# Altium project fieldsensor.PrjPCB
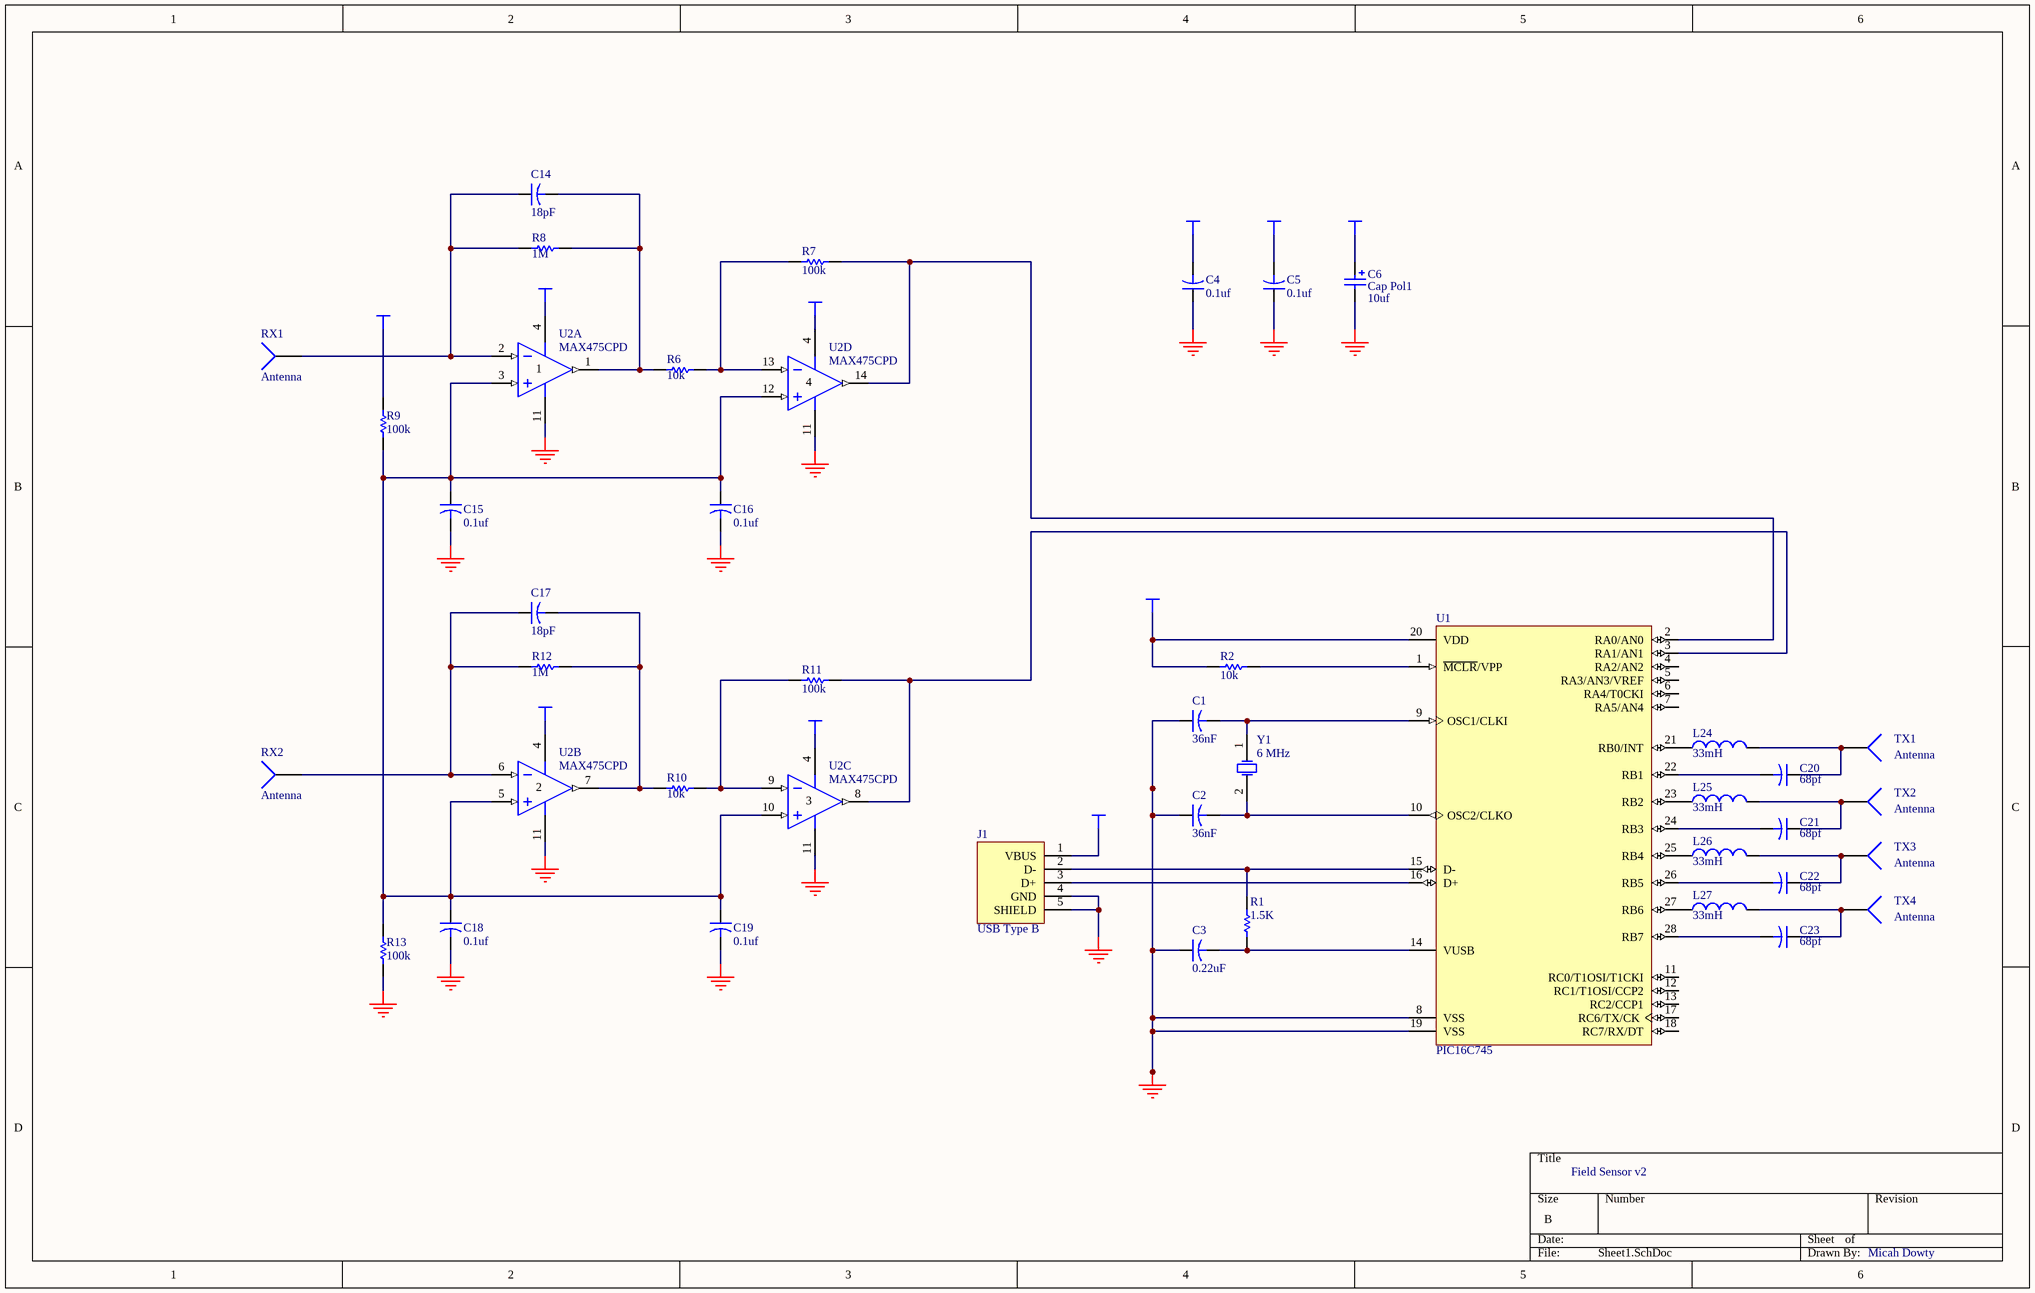
[diagram p0: Sheet1.SchDoc]
1 sheet, 40 parts. Net scope: global (net labels, ports and power ports of the same name join across sheets).
Board file: PCB1.PcbDoc

## Sheet Sheet1.SchDoc
size B

### Parts
C1  value 36nF  [CAPR5-4X5]  (hidden comment: Cap2)
C2  value 36nF  [CAPR5-4X5]  (hidden comment: Cap2)
C3  value 0.22uF  [CAPR5-4X5]
C4  value 0.1uf  [CAPR5-4X5]
C5  value 0.1uf  [CAPR5-4X5]
C6  Cap Pol1  value 10uf  [CAP-EE-1]
C14  value 18pF  [CAPR5-4X5]  (hidden comment: Cap2)
C15  value 0.1uf  [CAPR5-4X5]  (hidden comment: Cap2)
C16  value 0.1uf  [CAPR5-4X5]  (hidden comment: Cap2)
C17  value 18pF  [CAPR5-4X5]  (hidden comment: Cap2)
C18  value 0.1uf  [CAPR5-4X5]  (hidden comment: Cap2)
C19  value 0.1uf  [CAPR5-4X5]  (hidden comment: Cap2)
C20  value 68pf  [CAPR5-4X5]  (hidden comment: Cap2)
C21  value 68pf  [CAPR5-4X5]  (hidden comment: Cap2)
C22  value 68pf  [CAPR5-4X5]  (hidden comment: Cap2)
C23  value 68pf  [CAPR5-4X5]  (hidden comment: Cap2)
J1  USB  [USB-TYPEB]  (value not drawn)
L24  value 33mH  [RAD-0.2]
L25  value 33mH  [RAD-0.2]
L26  value 33mH  [RAD-0.2]
L27  value 33mH  [RAD-0.2]
R1  value 1.5K  [AXIAL-0.3]  (hidden comment: Res1)
R2  value 10k  [AXIAL-0.3]  (hidden comment: Res1)
R6  value 10k  [AXIAL-0.3]  (hidden comment: Res1)
R7  value 100k  [AXIAL-0.3]  (hidden comment: Res1)
R8  value 1M  [AXIAL-0.3]  (hidden comment: Res1)
R9  value 100k  [AXIAL-0.3]  (hidden comment: Res1)
R10  value 10k  [AXIAL-0.3]  (hidden comment: Res1)
R11  value 100k  [AXIAL-0.3]  (hidden comment: Res1)
R12  value 1M  [AXIAL-0.3]  (hidden comment: Res1)
R13  value 100k  [AXIAL-0.3]  (hidden comment: Res1)
RX1  Antenna  [FIELD_ANTENNA]
RX2  Antenna  [FIELD_ANTENNA]
TX1  Antenna  [FIELD_ANTENNA]
TX2  Antenna  [FIELD_ANTENNA]
TX3  Antenna  [FIELD_ANTENNA]
TX4  Antenna  [FIELD_ANTENNA]
U1  (no value)  [DIP-28]
U2  MAX475CPD  [DIP-14/D19.7]  (parts A,B,C,D of 4)
Y1  6 MHz  [BCY-W2/E4.7]

### Nets
GND: C1.1 C2.1 C3.1 C4.1 C5.1 C6.2 C15.2 C16.2 C18.2 C19.2 J1.4(GND) J1.5(SHIELD) R13.1 U1.8(VSS) U1.19(VSS) U2.11(VEE)
VCC: C4.2 C5.2 C6.1 J1.1(VBUS) R2.2 R9.2 U1.20(VDD) U2.4(VCC)
NetC1_2: C1.2 U1.9(OSC1/CLKI) Y1.1(OSC1)
NetC2_2: C2.2 U1.10(OSC2/CLKO) Y1.2(OSC2)
NetC3_2: C3.2 R1.1 U1.14(VUSB)
NetC14_1: C14.1 R8.1 RX1.1 U2.2(IN-)
NetC14_2: C14.2 R6.1 R8.2 U2.1(OUT)
NetC15_1: C15.1 C16.1 C18.1 C19.1 R9.1 R13.2 U2.3(IN+) U2.5(IN+) U2.10(IN+) U2.12(IN+)
NetC17_1: C17.1 R12.1 RX2.1 U2.6(IN-)
NetC17_2: C17.2 R10.1 R12.2 U2.7(OUT)
NetC20_1: C20.1 L24.2 TX1.1
NetC20_2: C20.2 U1.22(RB1)
NetC21_1: C21.1 L25.2 TX2.1
NetC21_2: C21.2 U1.24(RB3)
NetC22_1: C22.1 L26.2 TX3.1
NetC22_2: C22.2 U1.26(RB5)
NetC23_1: C23.1 L27.2 TX4.1
NetC23_2: C23.2 U1.28(RB7)
NetJ1_2: J1.2(D-) R1.2 U1.15(D-)
NetJ1_3: J1.3(D+) U1.16(D+)
NetL24_1: L24.1 U1.21(RB0/INT)
NetL25_1: L25.1 U1.23(RB2)
NetL26_1: L26.1 U1.25(RB4)
NetL27_1: L27.1 U1.27(RB6)
NetR2_1: R2.1 U1.1(~{MCLR}/VPP)
NetR6_2: R6.2 R7.1 U2.13(IN-)
NetR7_2: R7.2 U1.2(RA0/AN0) U2.14(OUT)
NetR10_2: R10.2 R11.1 U2.9(IN-)
NetR11_2: R11.2 U1.3(RA1/AN1) U2.8(OUT)

Not connected (* = marked no-connect by the designer): U1 4(RA2/AN2) 5(RA3/AN3/VREF) 6(RA4/T0CKI) 7(RA5/AN4) 11(RC0/T1OSI/T1CKI) 12(RC1/T1OSI/CCP2) 13(RC2/CCP1) 17(RC6/TX/CK) 18(RC7/RX/DT)

### Notes on the sheet
- Field Sensor v2
- Micah Dowty

### Library data of the parts
C1-C5 C14-C23 = Cap2: Capacitor; Manufacturer: Generic Components; Class I: Passive; Published: 23-Sep-2002; Publisher: Altium Limited; Class II: Capacitor
C6 = Cap Pol1: Polarized Capacitor (Radial); Manufacturer: Generic Components; Class I: Passive; Published: 8-Jun-2000; Revision: July-2002: Re-released for DXP Platform.; Publisher: Altium Limited; Class II: Capacitor
J1 = USB Type B: Header, 4-Pin; Manufacturer: Generic Components; Class I: Connector; Revision: July-2002: Re-released for DXP Platform.; Publisher: Altium Limited
L24-L27 = Inductor: Manufacturer: Generic Components; Class I: Passive; Published: 8-Jun-2000; Revision: July-2002: Re-released for DXP Platform.; Publisher: Altium Limited; Class II: Inductor
R1 R2 R6-R13 = Res1: Resistor; Manufacturer: Generic Components; Class I: Passive; Published: 8-Jun-2000; Revision: July-2002: Re-released for DXP Platform.; Publisher: Altium Limited; Class II: Resistor
RX1 RX2 TX1-TX4 = Socket: Manufacturer: Generic Components; Class I: Connector; Revision: July-2002: Re-released for DXP Platform.; Publisher: Altium Limited
U1 = PIC16C745: EPROM-Based 8-Bit CMOS Microcontroller with USB; Manufacturer: Microchip; Revision: Modified for PIC16C745 by Micah Dowty; Package Reference: P40; Class I: Microcontroller; Class II: 8-bit
U2 = MAX475CPD: Quad 10MHz, Single Supply Operational Amplifier; Manufacturer: Maxim; Published: 23-Sep-2002; Datasheet: Latest Revision: Rev 1; 3/95; Package Reference: PD14B; Publisher: Altium Limited; Class I: Amplifier; Class II: Operational Amplifier
Y1 = XTAL: Crystal Oscillator; Manufacturer: Generic Components; Published: 8-Jun-2000; Revision: July-2002: Re-released for DXP Platform.; Publisher: Altium Limited; Class I: Oscillator; Class II: Crystal Oscillator